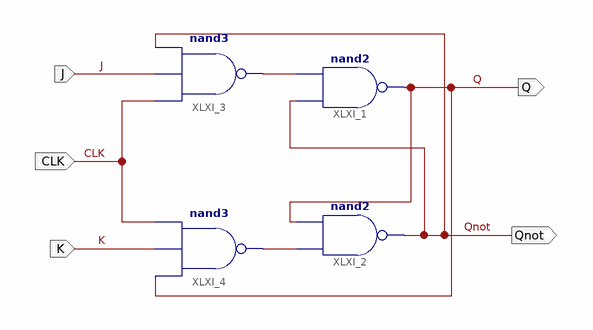
[diagram p0: schematic sheet 1]
// Xilinx ISE schematic JK_FlipFlop.sch (spartan3e) as structural Verilog: 4 symbols, 5 ports
module JK_FlipFlop (
  input  CLK,
  input  J,
  input  K,
  output Q,
  output Qnot
);

  wire XLXN_6, XLXN_7;

  nand XLXI_1 (Q, Qnot, XLXN_6);
  nand XLXI_2 (Qnot, XLXN_7, Q);
  nand XLXI_3 (XLXN_6, CLK, J, Qnot);
  nand XLXI_4 (XLXN_7, Q, K, CLK);
endmodule
